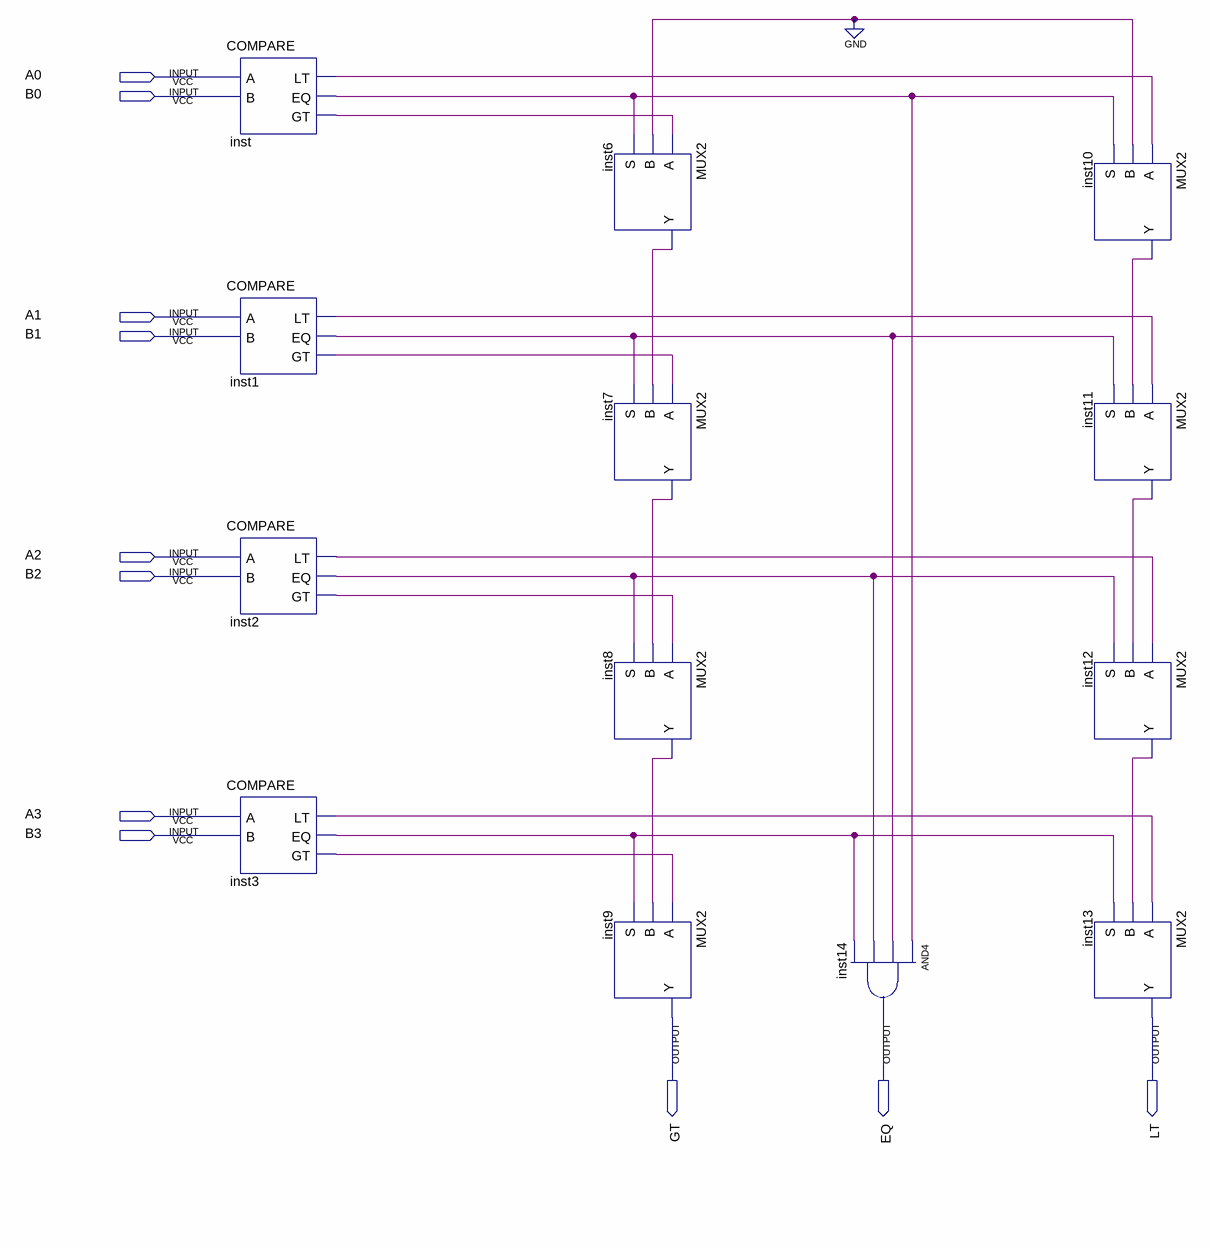
[diagram p0: schematic sheet]
// Quartus schematic COMPARE_4Bit.bdf as structural Verilog: 13 symbols, 11 pins
module COMPARE_4Bit (
  input  A0,
  input  B0,
  input  A1,
  input  B1,
  input  A2,
  input  B2,
  input  A3,
  input  B3,
  output GT,
  output EQ,
  output LT
);

  wire inst1_eq, inst1_gt, inst1_lt, inst2_eq, inst2_gt, inst2_lt, inst3_eq, inst3_gt, inst3_lt, inst6_y,
       inst7_y, inst8_y, inst10_y, inst11_y, inst12_y, inst_eq, inst_gt, inst_lt;

  COMPARE inst (.A(A0), .B(B0), .LT(inst_lt), .EQ(inst_eq), .GT(inst_gt));
  COMPARE inst1 (.A(A1), .B(B1), .LT(inst1_lt), .EQ(inst1_eq), .GT(inst1_gt));
  COMPARE inst2 (.A(A2), .B(B2), .LT(inst2_lt), .EQ(inst2_eq), .GT(inst2_gt));
  COMPARE inst3 (.A(A3), .B(B3), .LT(inst3_lt), .EQ(inst3_eq), .GT(inst3_gt));
  MUX2 inst6 (.A(inst_gt), .B(1'b0), .S(inst_eq), .Y(inst6_y));
  MUX2 inst7 (.A(inst1_gt), .B(inst6_y), .S(inst1_eq), .Y(inst7_y));
  MUX2 inst8 (.A(inst2_gt), .B(inst7_y), .S(inst2_eq), .Y(inst8_y));
  MUX2 inst9 (.A(inst3_gt), .B(inst8_y), .S(inst3_eq), .Y(GT));
  and inst14 (EQ, inst_eq, inst1_eq, inst2_eq, inst3_eq);
  MUX2 inst10 (.A(inst_lt), .B(1'b0), .S(inst_eq), .Y(inst10_y));
  MUX2 inst11 (.A(inst1_lt), .B(inst10_y), .S(inst1_eq), .Y(inst11_y));
  MUX2 inst12 (.A(inst2_lt), .B(inst11_y), .S(inst2_eq), .Y(inst12_y));
  MUX2 inst13 (.A(inst3_lt), .B(inst12_y), .S(inst3_eq), .Y(LT));
endmodule
